# EAGLE schematic encoder (EAGLE 7.2.0)
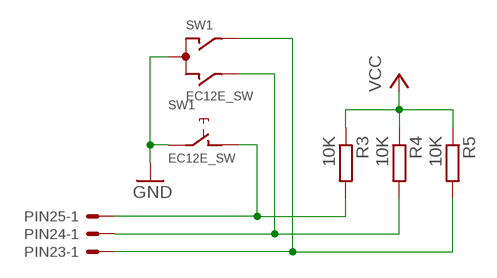
[diagram p0: schematic, sheet 1]

## Parts
PIN23  5566-10  [5566-10]
PIN24  5566-10  [5566-10]
PIN25  5566-10  [5566-10]
R3  10K  R-EU_M1206  [M1206]
R4  10K  R-EU_M1206  [M1206]
R5  10K  R-EU_M1206  [M1206]
SW1  EC12E_SW  [ALPS_EC12E_SW]

## Nets
GND: SW1.C SW1.E
N$5: PIN23.1 R5.2 SW1.A
N$9: PIN24.1 R4.2 SW1.B
N$10: PIN25.1 R3.2 SW1.D
VCC: R3.1 R4.1 R5.1
Unconnected: PIN23.2 PIN23.3 PIN23.4 PIN23.5 PIN23.6 PIN23.7 PIN23.8 PIN23.9 PIN23.10 PIN24.2 PIN24.3 PIN24.4 PIN24.5 PIN24.6 PIN24.7 PIN24.8 PIN24.9 PIN24.10 PIN25.2 PIN25.3 PIN25.4 PIN25.5 PIN25.6 PIN25.7 PIN25.8 PIN25.9 PIN25.10 SW1.GND1(G) SW1.GND2(G)

## Library data of the parts
PIN23-PIN25 = con-molex:5566-10: Mini FIT connector 10 pol Source: http://www.molex.com; OC_FARNELL: unknown; OC_NEWARK: unknown
R3-R5 = resistor:R-EU_: RESISTOR, European symbol
SW1 = switch-alps:EC12E_SW: ALPS rotary Encoder EC12E series with switch; MPN: EC12E2424407; OC_FARNELL: 1520813; OC_NEWARK: 74M1068